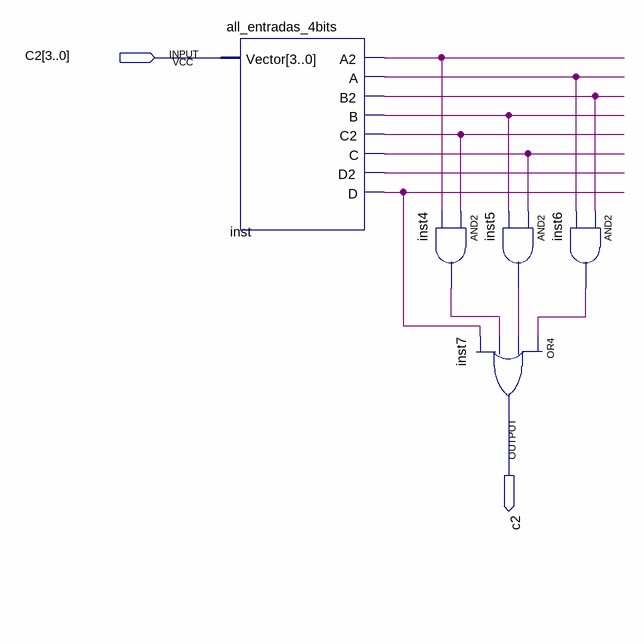
[diagram p0: schematic sheet]
// Quartus schematic c2_4bits.bdf as structural Verilog: 5 symbols, 2 pins
module c2_4bits (
  input  [3:0] C2,
  output C2_1bit
);

  wire inst4_out, inst5_out, inst6_out, inst_a, inst_a2, inst_b, inst_b2, inst_c, inst_c2, inst_d, inst_d2;

  all_entradas_4bits inst (
    .Vector(C2), .A2(inst_a2), .A(inst_a), .B2(inst_b2), .B(inst_b), .C2(inst_c2), .C(inst_c), .D2(inst_d2),
    .D(inst_d));
  and inst4 (inst4_out, inst_c2, inst_a2);
  or inst7 (C2_1bit, inst6_out, inst5_out, inst4_out, inst_d);
  and inst5 (inst5_out, inst_c, inst_b);
  and inst6 (inst6_out, inst_b2, inst_a);
endmodule
